# Altium schematic sheet 基于单片机的无线红外防盗报警系统原理图从机.SchDoc
size A2
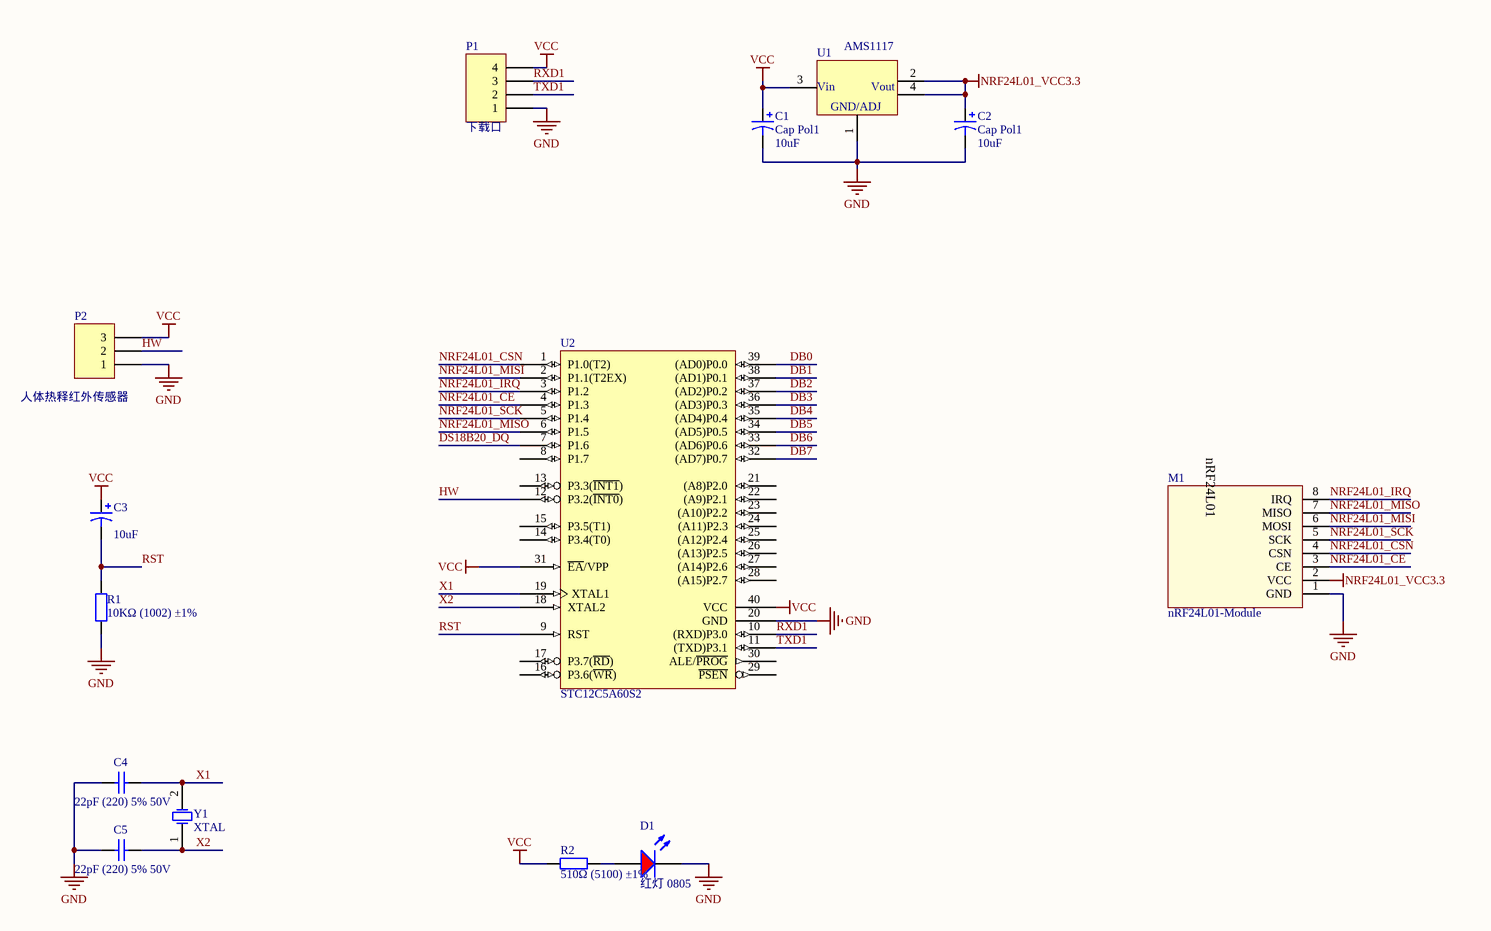
[diagram p0: 基于单片机的无线红外防盗报警系统原理图从机.SchDoc]

## Parts
C1  Cap Pol1  value 10uF  [RB.2.5/.6.3mm]
C2  Cap Pol1  value 10uF  [RB.2.5/.6.3mm]
C3  value 10uF  [RB.2.5/.6.3mm]  (hidden comment: Cap Pol1)
C4  22pF (220) 5% 50V  [LC-0805_C]
C5  22pF (220) 5% 50V  [LC-0805_C]
D1  红灯 0805  [LC-0805_LED_S1]
M1  nRF24L01-Module  [HDR2X4]
P1  下载口  [HDR1X4]
P2  人体热释红外传感器  [HDR1X3]
R1  10KΩ (1002) ±1%  [LC-0805_R]
R2  510Ω (5100) ±1%  [LC-0805_R]
U1  AMS1117  [LC-SOT-223]
U2  STC12C5A60S2  [DIP40]
Y1  XTAL  [R38]

## Nets
GND: C1.2 C2.2 C4.1 C5.1 D1.K M1.1(GND) P1.1 P2.1 R1.1 U1.1 U2.20(GND)
NRF24L01_VCC3.3: C2.1 M1.2(VCC) U1.2 U1.4
VCC: C1.1 C3.1 P1.4 P2.3 R2.1 U1.3 U2.31(~{EA}/VPP) U2.40(VCC)
DB0: U2.39((AD0)P0.0)
DB1: U2.38((AD1)P0.1)
DB2: U2.37((AD2)P0.2)
DB3: U2.36((AD3)P0.3)
DB4: U2.35((AD4)P0.4)
DB5: U2.34((AD5)P0.5)
DB6: U2.33((AD6)P0.6)
DB7: U2.32((AD7)P0.7)
DS18B20_DQ: U2.7(P1.6)
HW: P2.2 U2.12(P3.2(~{INT0}))
NRF24L01_CE: M1.3(CE) U2.4(P1.3)
NRF24L01_CSN: M1.4(CSN) U2.1(P1.0(T2))
NRF24L01_IRQ: M1.8(IRQ) U2.3(P1.2)
NRF24L01_MISI: M1.6(MOSI) U2.2(P1.1(T2EX))
NRF24L01_MISO: M1.7(MISO) U2.6(P1.5)
NRF24L01_SCK: M1.5(SCK) U2.5(P1.4)
RST: C3.2 R1.2 U2.9(RST)
RXD1: P1.3 U2.10((RXD)P3.0)
TXD1: P1.2 U2.11((TXD)P3.1)
X1: C4.2 U2.19(XTAL1) Y1.2(OSC2)
X2: C5.2 U2.18(XTAL2) Y1.1(OSC1)
NetD1_A: D1.A R2.2

Not connected (* = marked no-connect by the designer): U2 8(P1.7) 13(P3.3(~{INT1})) 14(P3.4(T0)) 15(P3.5(T1)) 16(P3.6(~{WR})) 17(P3.7(~{RD})) 21((A8)P2.0) 22((A9)P2.1) 23((A10)P2.2) 24((A11)P2.3) 25((A12)P2.4) 26((A13)P2.5) 27((A14)P2.6) 28((A15)P2.7) 29(~{PSEN}) 30(ALE/~{PROG})

## Notes on the sheet
- (in symbol AMS1117) Vin; Vout; GND/ADJ
- (in symbol nRF24L01-Module) nRF24L01

## Library data of the parts
C1-C3 = Cap Pol1: Polarized Capacitor (Radial); Published: 8-Jun-2000; LatestRevisionDate: 17-Jul-2002; LatestRevisionNote: Re-released for DXP Platform.; PackageReference: RB7.6-15; Publisher: Altium Limited; PackageDescription: Polarized Capacitor (Radial); 2 Leads
C4 C5 = 0805 22pF (220) 5% 50V: 贴片电容; ComponentLink1Description: 供应商链接; ComponentLink1URL: http://www.szlcsc.com/product/details_2156.html; Package: 0805; Supplier: LC; SuppliersPartNumber: C1804
D1 = 0805 红灯: 发光二极管; ComponentLink1Description: 供应商链接; ComponentLink1URL: http://www.szlcsc.com/product/details_2668.html; Package: 0805; Supplier: LC; SuppliersPartNumber: C2295
P1 = Header 4: Header, 4-Pin; LatestRevisionDate: 17-Jul-2002; LatestRevisionNote: Re-released for DXP Platform.; Publisher: Altium Limited
P2 = Header 3: Header, 3-Pin; LatestRevisionDate: 17-Jul-2002; LatestRevisionNote: Re-released for DXP Platform.; Publisher: Altium Limited
R1 = 0805 10KΩ (1002) 1%: 贴片电阻; ComponentLink1Description: 供应商链接; ComponentLink1URL: http://www.szlcsc.com/product/details_18102.html; Package: 0805; Supplier: LC; SuppliersPartNumber: C17414
R2 = 0805 510Ω (5100) 1%: 贴片电阻; ComponentLink1Description: 供应商链接; ComponentLink1URL: http://www.szlcsc.com/product/details_18422.html; Package: 0805; Supplier: LC; SuppliersPartNumber: C17734
U2 = AT89C52: 8-Bit Microcontroller with 8K Flash ROM
Y1 = XTAL: Crystal Oscillator; Published: 8-Jun-2000; LatestRevisionDate: 17-Jul-2002; LatestRevisionNote: Re-released for DXP Platform.; PackageReference: R38; Publisher: Altium Limited; PackageDescription: Crystal, Thru-Hole; 2 Leads; Body 3.1 x 8.2 mm (Dia.xH)